# Altium project ServoPusher.PrjPcb
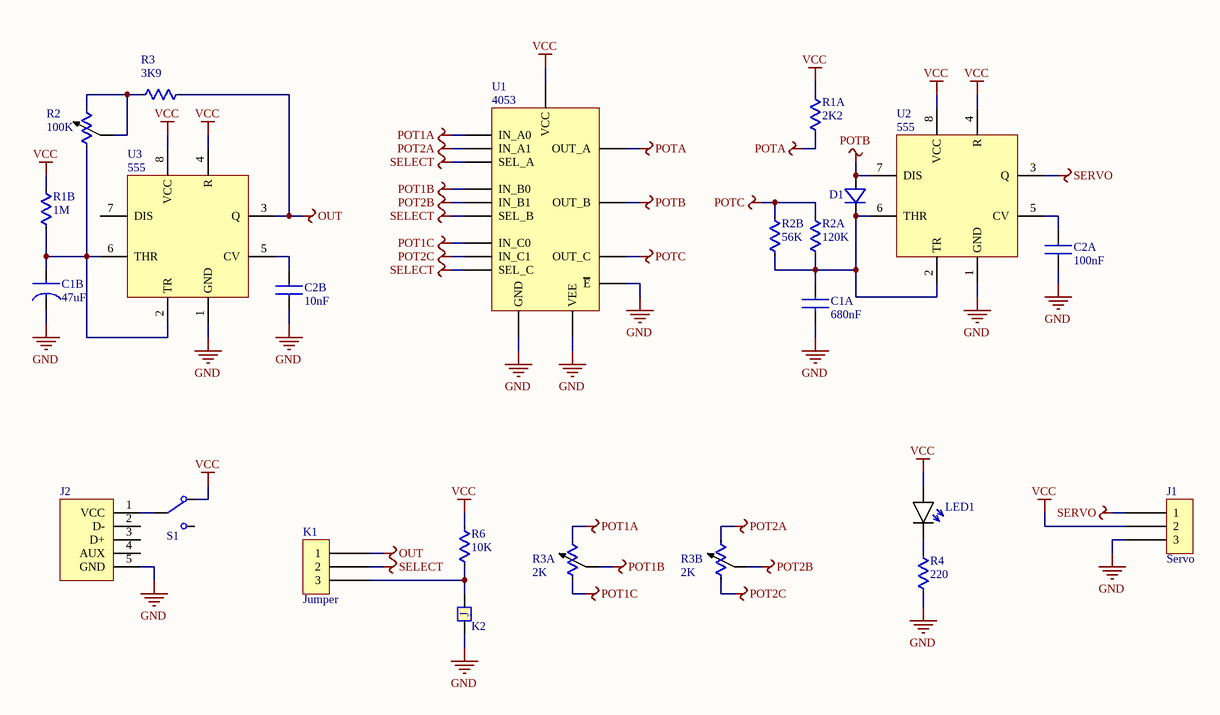
[diagram p0: PCB.SchDoc]
1 sheet, 24 parts. Net scope: global (net labels, ports and power ports of the same name join across sheets).
Board file: PCB.PcbDoc

## Sheet PCB.SchDoc
size A4

### Parts
C1A  value 680nF  [CAP_POL_20MM]  (hidden comment: CAP-CER)
C1B  value 47uF  [CAP-ELEC-5x11x2mm]  (hidden comment: CAP-ELEC)
C2A  value 100nF  [CAP-CER]  (hidden comment: CAP-CER)
C2B  value 10nF  [CAP-CER]  (hidden comment: CAP-CER)
D1  DIODE  [DO-41]  (value not drawn)
J1  Servo  [Header 1x3]
J2  MINI USB  [5075BMR-05]  (value not drawn)
K1  Jumper  [Header 1x3]
K2  JUMPER  [JUMPER]  (value not drawn)
LED1  LED  [LED-3MM-GREEN]  (value not drawn)
R1A  value 2K2  [RES-Axial-400mil]  (hidden comment: RES)
R1B  value 1M  [RES-Axial-400mil]  (hidden comment: RES)
R2  value 100K  [TRIMPOT]  (hidden comment: POT)
R2A  value 120K  [RES-Axial-400mil]  (hidden comment: RES)
R2B  value 56K  [RES-Axial-400mil]  (hidden comment: RES)
R3  value 3K9  [RES-Axial-400mil]  (hidden comment: RES)
R3A  value 2K  [TRIMPOT]  (hidden comment: POT)
R3B  value 2K  [TRIMPOT]  (hidden comment: POT)
R4  value 220  [RES-Axial-400mil]  (hidden comment: RES)
R6  value 10K  [RES-Axial-400mil]  (hidden comment: RES)
S1  SLIDE-SWITCH  [SWITCH]  (value not drawn)
U1  4053  [DIP16]
U2  555  [DIP8]
U3  555  [DIP8]

### Nets
GND: C1A.1 C1B.2 C2A.1 C2B.2 J1.3 J2.5(GND) K2.2 R4.2 U1.6(E) U1.7(VEE) U1.8(GND) U2.1(GND) U3.1(GND)
OUT: K1.1 R3.2 U3.3(Q)
POT1A: R3A.1 U1.12(IN_A0)
POT1B: R3A.2 U1.2(IN_B0)
POT1C: R3A.3 U1.5(IN_C0)
POT2A: R3B.1 U1.13(IN_A1)
POT2B: R3B.2 U1.1(IN_B1)
POT2C: R3B.3 U1.3(IN_C1)
POTA: R1A.1 U1.14(OUT_A)
POTB: D1.A U1.15(OUT_B) U2.7(DIS)
POTC: R2A.2 R2B.2 U1.4(OUT_C)
SELECT: K1.2 U1.9(SEL_C) U1.10(SEL_B) U1.11(SEL_A)
SERVO: J1.1 U2.3(Q)
VCC: J1.2 LED1.A R1A.2 R1B.2 R6.2 S1.1 U1.16(VCC) U2.4(R) U2.8(VCC) U3.4(R) U3.8(VCC)
NetC1A_2: C1A.2 D1.K R2A.1 R2B.1 U2.2(TR) U2.6(THR)
NetC1B_1: C1B.1 R1B.1 R2.3 U3.2(TR) U3.6(THR)
NetC2A_2: C2A.2 U2.5(CV)
NetC2B_1: C2B.1 U3.5(CV)
NetJ2_1: J2.1(VCC) S1.2
NetK1_3: K1.3 K2.1 R6.1
NetLED1_K: LED1.K R4.1
NetR2_1: R2.1 R2.2 R3.1

Not connected (* = marked no-connect by the designer): J2 2(D-) 3(D+) 4(AUX); S1 3; U3 7(DIS)

### Notes on the sheet
- (in symbol JUMPER) J

### Library data of the parts
D1 = DIODE: NAME: 1N4007
J1 K1 = Header 1x3